# Altium schematic sheet BH1730FVC_top.SchDoc: Electrical Power System - General Block Diagram
size A4; Date: 2015-02-21; CheckedBy: Piotr Kuligowski; Author: Michał Gumiela; DocumentNumber: 1; Revision: 1-0; SheetNumber: 1; SheetTotal: 2; Model: DM1; PageSetup: Record=PageOptions|CenterHorizontal=True|CenterVertical=True|PrintScale=0.52|XCorrection=1.00|YCorrection=1.00|PrintKind=1|BorderSize=5000000|LeftOffset=0|BottomOffset=0|Orientation=2|PaperLength=4200|PaperWidth=2970|Scale=100|PaperSource=7|PrintQuality=600|MediaType=1|DitherType=10|PaperKind=A3|PrintScaleMode=1
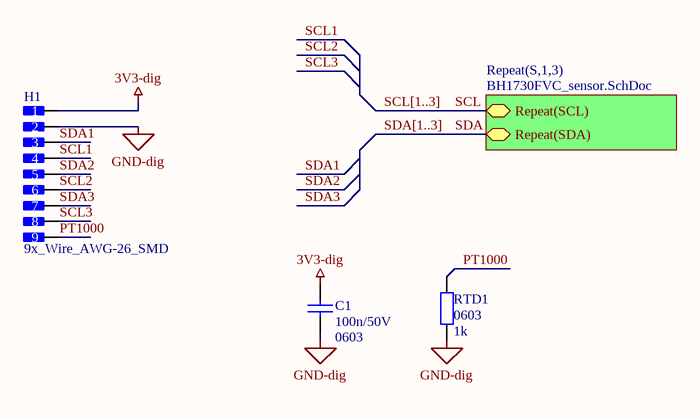
[diagram p0: BH1730FVC_top.SchDoc]

## Parts
C1  Package: 0603  [SMD_Capacitor_0603]  (hidden comment: 100n/50V)
H1  9x_Wire_AWG-26_SMD  [Wire_AWG-26_x9_SMD]
RTD1  Package: 0603  [SMD_Resistor_0603]  (hidden comment: 1k)

## Sub-sheets
Repeat(S,1,3) = BH1730FVC_sensor.SchDoc: Repeat(SCL) (bidir), Repeat(SDA) (bidir)

## Nets
3V3-dig: C1.1 H1.1
GND-dig: C1.2 H1.2 RTD1.2
PT1000: H1.9 RTD1.1
SCL: sheet Repeat(S,1,3)/Repeat(SCL)
SCL1: H1.4
SCL2: H1.6
SCL3: H1.8
SDA: sheet Repeat(S,1,3)/Repeat(SDA)
SDA1: H1.3
SDA2: H1.5
SDA3: H1.7

## Buses and harness runs
bus SCL[1..3]
bus SDA[1..3]

## Notes on the sheet
- Title:
- Sheet:
- of
- Author:
- Model:
- Document Number:
- Checked by:
- Iss-Rev:
- Approved by:
- Date:
- File name:

## Library data of the parts
C1 = Cer_C0603T104K5RALTU: Ceramic Cap Kemet COTS 100n/50V X7R 0603; Manufacturer: Kemet; ManufacturerPartNumber: C0603T104K5RALTU; Value: 100n/50V
H1 = Wire_AWG-26_x9_SMD_1: 9 x SMD pads for an AWG-26 wire with stress relief, pitch 1.27mm.; Value: 9x_Wire_AWG-26_SMD
RTD1 = PTS060301B100RP100: PT1000 Vishay PTS060301B100RP100; Manufacturer: Vishay; ManufacturerPartNumber: PTS060301B100RP100; Value: 1k